# Altium schematic sheet Launchpad.SchDoc
size A4; Organization: Altium Limited; Address1: L3, 12a Rodborough Rd; Address2: Frenchs Forest; Address3: NSW; Address4: Australia 2086; SheetNumber: 2
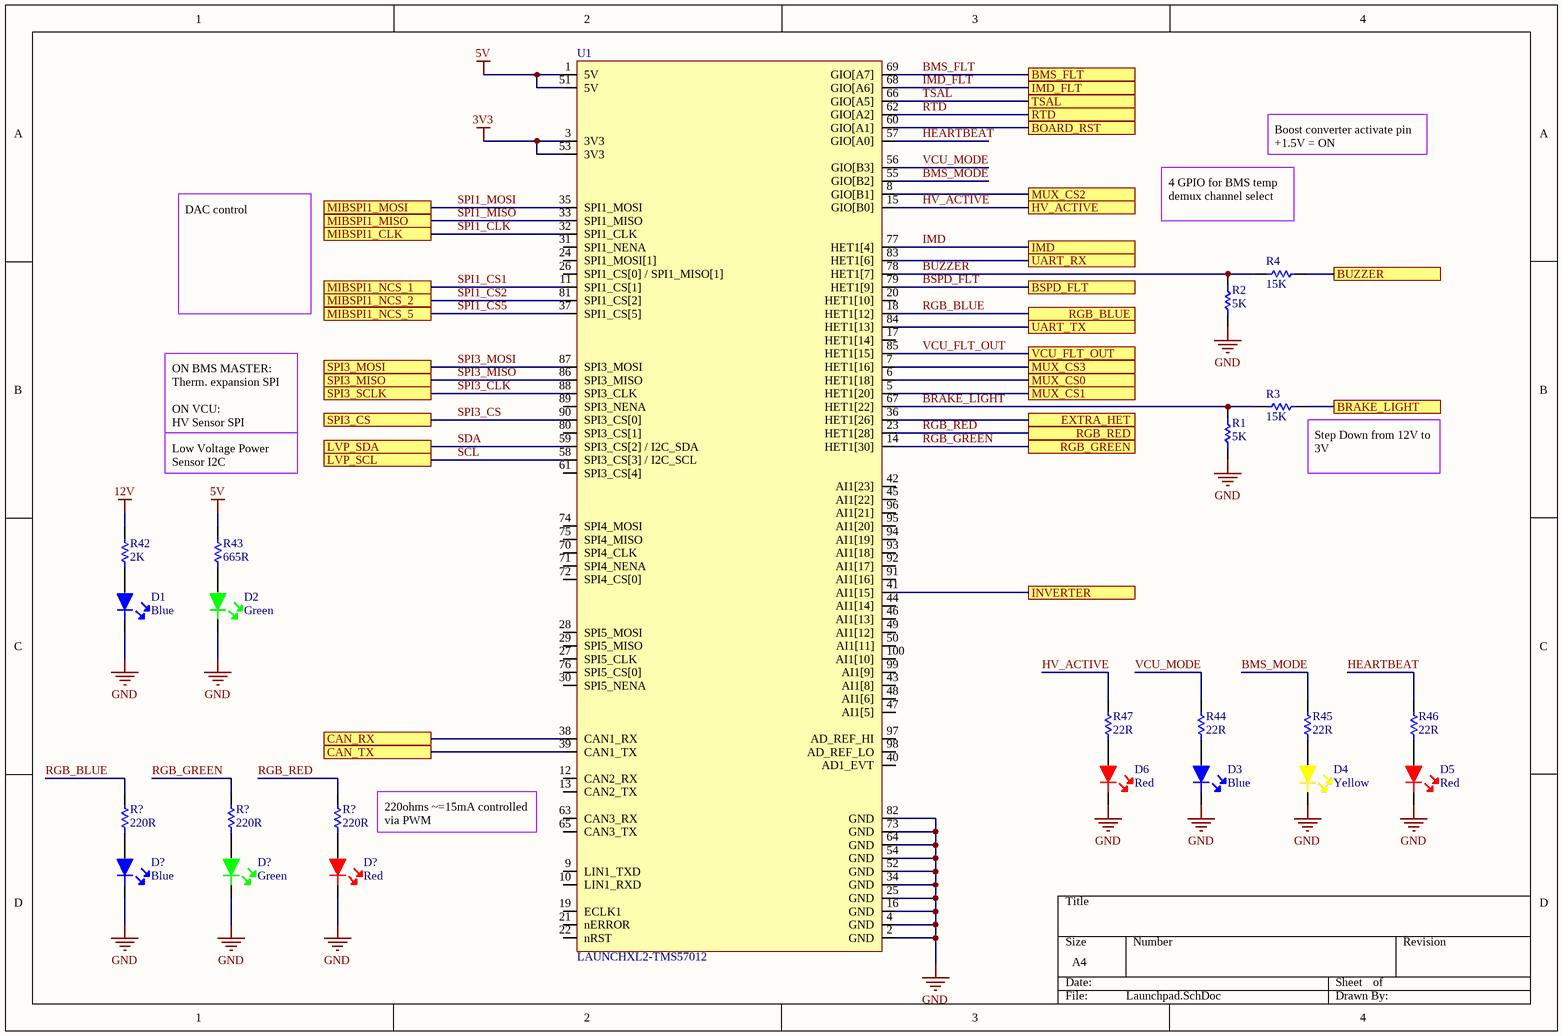
[diagram p0: Launchpad.SchDoc]

## Parts
(Parts that share a designator on the sheet are numbered #1, #2 ... from top to bottom, then left to right.)
D1  Blue  [LED-0603]
D2  Green  [LED-0603]
D3  Blue  [LED-0603]
D4  Yellow  [LED-0603]
D5  Red  [LED-0603]
D6  Red  [LED-0603]
D?#1  Blue  [LED-0603]
D?#2  Green  [LED-0603]
D?#3  Red  [LED-0603]
R1  5K  [RES-0603]
R2  5K  [RES-0603]
R3  15K  [RES-0603]
R4  15K  [RES-0603]
R42  2K  [RES-0603]
R43  665R  [RES-0603]
R44  22R  [RES-0603]
R45  22R  [RES-0603]
R46  22R  [RES-0603]
R47  22R  [RES-0603]
R?#1  220R  [RES-0603]
R?#2  220R  [RES-0603]
R?#3  220R  [RES-0603]
U1  LAUNCHXL2-TMS57012  [Hercules]

## Ports
BMS_FLT, BOARD_RST, BRAKE_LIGHT, BSPD_FLT, BUZZER, CAN_RX, CAN_TX, EXTRA_HET, HV_ACTIVE, IMD, IMD_FLT, INVERTER, LVP_SCL, LVP_SDA, MIBSPI1_CLK, MIBSPI1_MISO, MIBSPI1_MOSI, MIBSPI1_NCS_1, MIBSPI1_NCS_2, MIBSPI1_NCS_5, MUX_CS0, MUX_CS1, MUX_CS2, MUX_CS3, RGB_BLUE, RGB_GREEN, RGB_RED, RTD, SPI3_CS, SPI3_MISO, SPI3_MOSI, SPI3_SCLK, TSAL, UART_RX, UART_TX, VCU_FLT_OUT

## Nets
3V3: U1.3(3V3) U1.53(3V3)
5V: R43.2 U1.1(5V) U1.51(5V)
12V: R42.2
GND: D1.2 D2.2 D3.2 D4.2 D5.2 D6.2 D?#1.2 D?#2.2 D?#3.2 R1.1 R2.1 U1.2(GND) U1.4(GND) U1.16(GND) U1.25(GND) U1.34(GND) U1.52(GND) U1.54(GND) U1.64(GND) U1.73(GND) U1.82(GND)
BMS_FLT: U1.69(GIO[A7]) ; port BMS_FLT
BMS_MODE: R45.2 U1.55(GIO[B2])
BOARD_RST: U1.60(GIO[A1]) ; port BOARD_RST
BRAKE_LIGHT: R1.2 R3.1 U1.67(HET1[22])
BRAKE_LIGHT: R3.2 ; port BRAKE_LIGHT  [a separate net that carries the same name]
BSPD_FLT: U1.79(HET1[9]) ; port BSPD_FLT
BUZZER: R2.2 R4.1 U1.78(HET1[7])
BUZZER: R4.2 ; port BUZZER  [a separate net that carries the same name]
CAN_RX: U1.38(CAN1_RX) ; port CAN_RX
CAN_TX: U1.39(CAN1_TX) ; port CAN_TX
EXTRA_HET: U1.36(HET1[26]) ; port EXTRA_HET
HEARTBEAT: R46.2 U1.57(GIO[A0])
HV_ACTIVE: R47.2 U1.15(GIO[B0]) ; port HV_ACTIVE
IMD: U1.77(HET1[4]) ; port IMD
IMD_FLT: U1.68(GIO[A6]) ; port IMD_FLT
INVERTER: U1.41(AI1[15]) ; port INVERTER
MUX_CS0: U1.6(HET1[18]) ; port MUX_CS0
MUX_CS1: U1.5(HET1[20]) ; port MUX_CS1
MUX_CS2: U1.8(GIO[B1]) ; port MUX_CS2
MUX_CS3: U1.7(HET1[16]) ; port MUX_CS3
RGB_BLUE: R?#1.2 U1.18(HET1[12]) ; port RGB_BLUE
RGB_GREEN: R?#2.2 U1.14(HET1[30]) ; port RGB_GREEN
RGB_RED: R?#3.2 U1.23(HET1[28]) ; port RGB_RED
RTD: U1.62(GIO[A2]) ; port RTD
SCL: U1.58(SPI3_CS[3]_/_I2C_SCL) ; port LVP_SCL
SDA: U1.59(SPI3_CS[2]_/_I2C_SDA) ; port LVP_SDA
SPI1_CLK: U1.32(SPI1_CLK) ; port MIBSPI1_CLK
SPI1_CS1: U1.11(SPI1_CS[1]) ; port MIBSPI1_NCS_1
SPI1_CS2: U1.81(SPI1_CS[2]) ; port MIBSPI1_NCS_2
SPI1_CS5: U1.37(SPI1_CS[5]) ; port MIBSPI1_NCS_5
SPI1_MISO: U1.33(SPI1_MISO) ; port MIBSPI1_MISO
SPI1_MOSI: U1.35(SPI1_MOSI) ; port MIBSPI1_MOSI
SPI3_CLK: U1.88(SPI3_CLK) ; port SPI3_SCLK
SPI3_CS: U1.90(SPI3_CS[0]) ; port SPI3_CS
SPI3_MISO: U1.86(SPI3_MISO) ; port SPI3_MISO
SPI3_MOSI: U1.87(SPI3_MOSI) ; port SPI3_MOSI
TSAL: U1.66(GIO[A5]) ; port TSAL
UART_RX: U1.83(HET1[6]) ; port UART_RX
UART_TX: U1.84(HET1[13]) ; port UART_TX
VCU_FLT_OUT: U1.85(HET1[15]) ; port VCU_FLT_OUT
VCU_MODE: R44.2 U1.56(GIO[B3])
NetD1_1: D1.1 R42.1
NetD2_1: D2.1 R43.1
NetD3_1: D3.1 R44.1
NetD4_1: D4.1 R45.1
NetD5_1: D5.1 R46.1
NetD6_1: D6.1 R47.1
NetD?#1_1: D?#1.1 R?#1.1
NetD?#2_1: D?#2.1 R?#2.1
NetD?#3_1: D?#3.1 R?#3.1

Not connected (* = marked no-connect by the designer): U1 9(LIN1_TXD) 10(LIN1_RXD) 12(CAN2_RX) 13(CAN2_TX) 17(HET1[14]) 19(ECLK1) 20(HET1[10]) 21(nERROR) 22(nRST) 24(SPI1_MOSI[1]) 26(SPI1_CS[0]_/_SPI1_MISO[1]) 27(SPI5_CLK) 28(SPI5_MOSI) 29(SPI5_MISO) 30(SPI5_NENA) 31(SPI1_NENA) 40(AD1_EVT) 42(AI1[23]) 43(AI1[8]) 44(AI1[14]) 45(AI1[22]) 46(AI1[13]) 47(AI1[5]) 48(AI1[6]) 49(AI1[12]) 50(AI1[11]) 61(SPI3_CS[4]) 63(CAN3_RX) 65(CAN3_TX) 70(SPI4_CLK) 71(SPI4_NENA) 72(SPI4_CS[0]) 74(SPI4_MOSI) 75(SPI4_MISO) 76(SPI5_CS[0]) 80(SPI3_CS[1]) 89(SPI3_NENA) 91(AI1[16]) 92(AI1[17]) 93(AI1[18]) 94(AI1[19]) 95(AI1[20]) 96(AI1[21]) 97(AD_REF_HI) 98(AD_REF_LO) 99(AI1[9]) 100(AI1[10])

## Notes on the sheet
- Boost converter activate pin
  +1.5V = ON
- 4 GPIO for BMS temp demux channel select
- DAC control
- ON BMS MASTER:
  Therm. expansion SPI
  ON VCU:
  HV Sensor SPI
- Low Voltage Power Sensor I2C
- (near R3) Step Down from 12V to 3V
- 220ohms ~=15mA controlled via PWM
- Title
- Size:
- Date:
- B
- Number:
- Time:
- Revision:
- Sheet
- of
- File:

## Library data of the parts
D1 D3 D?#1 = LED-Blue: LED BLUE CLEAR 0603 SMD; Manufacturer: Wurth Electronics; Manufacturer Part Number: 150060BS75000; Luminous Intensity: 145mcd; Forward Current: 30mA; Forward Voltage: 3.2V; Wavelength: 470nm; Viewing Angle: 140°; Lens Style: Clear,Rectangular; Test Current: 20mA; Supplier 1: Digi-Key; Stock 1: 46078; Pricing 1: 1=0.16, 50=0.145, 100=0.125, 500=0.108 (USD); Mount: Surface Mount; Case/Package: 0603; Color: Blue; Case Code (Metric): 1608; Case Code (Imperial): 0603; Min Operating Temperature: -40°C; Max Operating Temperature: 85°C; Package Quantity: 4000; Packaging: Cut Tape; Dominant Wavelength: 470nm; Length: 1.6mm; Height: 0.7mm; Width: 0.8mm; REACH SVHC: Unknown; ComponentLink1URL: https://www.distrelec.biz/Web/Downloads/_t/ds/150060BS75000_eng_tds.pdf?mime=application%2Fpdf&src-supplier=Distrelec; ComponentLink1Description: https://www.distrelec.biz/Web/Downloads/_t/ds/150060BS75000_eng_tds.pdf?mime=application%2Fpdf&src-supplier=Distrelec; ComponentLink2URL: https://katalog.we-online.de/led/datasheet/150060BS75000.pdf?src-supplier=Digi-Key; ComponentLink2Description: https://katalog.we-online.de/led/datasheet/150060BS75000.pdf?src-supplier=Digi-Key; ComponentLink3URL: http://www.farnell.com/datasheets/1911343.pdf?src-supplier=Element14; ComponentLink3Description: http://www.farnell.com/datasheets/1911343.pdf?src-supplier=Element14; ComponentLink4URL: http://www.produktinfo.conrad.com/datenblaetter/750000-774999/759426-da-01-en-CHIPLED_0603_W_KL_BLAU_150060BS75000.pdf?src-supplier=Conrad; ComponentLink4Description: http://www.produktinfo.conrad.com/datenblaetter/750000-774999/759426-da-01-en-CHIPLED_0603_W_KL_BLAU_150060BS75000.pdf?src-supplier=Conrad; Supplier Part Number 1: 732-4966-6-ND
D2 D?#2 = LED-Green: LED GREEN CLEAR 0603 SMD; Manufacturer: Wurth Electronics; Manufacturer Part Number: 150060VS75000; Luminous Intensity: 40mcd; Viewing Angle: 140°; Forward Voltage: 2V; Wavelength: 570nm; Lens Style: Clear,Rectangular; Forward Current: 30mA; Test Current: 20mA; Supplier 1: Digi-Key; Stock 1: 118118; Pricing 1: 1=0.14, 50=0.133, 100=0.114, 500=0.099 (USD); Mount: Surface Mount; Case/Package: 0603; Number of Pins: 2; Color: Green; Case Code (Metric): 1608; Case Code (Imperial): 0603; Min Operating Temperature: -40°C; Max Operating Temperature: 85°C; Package Quantity: 1; Packaging: Tape and Reel; Dominant Wavelength: 570nm; Length: 1.6mm; Height: 0.7mm; Width: 0.8mm; REACH SVHC: Unknown; ComponentLink1URL: https://katalog.we-online.de/led/datasheet/150060VS75000.pdf?src-supplier=Digi-Key; ComponentLink1Description: https://katalog.we-online.de/led/datasheet/150060VS75000.pdf?src-supplier=Digi-Key; Supplier Part Number 1: 732-4980-1-ND
D4 = LED-Yellow: LED YELLOW CLEAR 0603 SMD; Manufacturer: Wurth Electronics; Manufacturer Part Number: 150060YS75000; Viewing Angle: 140°; Lens Style: Clear,Rectangular; Wavelength: 590nm; Luminous Intensity: 120mcd; Forward Voltage: 2V; Forward Current: 30mA; Test Current: 20mA; Supplier 1: Digi-Key; Stock 1: 78; Pricing 1: 1=0.14, 50=0.133, 100=0.114, 500=0.099 (USD); Mount: Surface Mount; Case/Package: 0603; Case Code (Metric): 1608; Case Code (Imperial): 0603; Color: Yellow; Min Operating Temperature: -40°C; Max Operating Temperature: 85°C; Package Quantity: 4000; Packaging: Tape and Reel; Dominant Wavelength: 590nm; Length: 1.6mm; Height: 0.7mm; Width: 0.8mm; REACH SVHC: Unknown; ComponentLink1URL: http://katalog.we-online.de/led/datasheet/150060YS75000.pdf?src-supplier=Newark; ComponentLink1Description: http://katalog.we-online.de/led/datasheet/150060YS75000.pdf?src-supplier=Newark; ComponentLink2URL: https://katalog.we-online.de/led/datasheet/150060YS75000.pdf?src-supplier=Digi-Key; ComponentLink2Description: https://katalog.we-online.de/led/datasheet/150060YS75000.pdf?src-supplier=Digi-Key; ComponentLink3URL: http://www.farnell.com/datasheets/1911348.pdf?src-supplier=Element14; ComponentLink3Description: http://www.farnell.com/datasheets/1911348.pdf?src-supplier=Element14; ComponentLink4URL: https://www.distrelec.biz/Web/Downloads/_t/ds/150060YS75000_eng_tds.pdf?mime=application%2Fpdf&src-supplier=Distrelec; ComponentLink4Description: https://www.distrelec.biz/Web/Downloads/_t/ds/150060YS75000_eng_tds.pdf?mime=application%2Fpdf&src-supplier=Distrelec; ComponentLink5URL: http://www.produktinfo.conrad.com/datenblaetter/750000-774999/759432-da-01-en-CHIPLED_0603_W_KL_GELB_150060YS75000.pdf?src-supplier=Conrad; ComponentLink5Description: http://www.produktinfo.conrad.com/datenblaetter/750000-774999/759432-da-01-en-CHIPLED_0603_W_KL_GELB_150060YS75000.pdf?src-supplier=Conrad; Supplier Part Number 1: 732-4981-6-ND
D5 D6 D?#3 = LED-Red: LED RED CLEAR 0603 SMD; Manufacturer: Wurth Electronics; Manufacturer Part Number: 150060RS75000; Viewing Angle: 140°; Lens Style: Clear,Rectangular; Luminous Intensity: 250mcd; Forward Current: 30mA; Forward Voltage: 2V; Wavelength: 625nm; Test Current: 20mA; Supplier 1: Digi-Key; Stock 1: 18518; Pricing 1: 1=0.14, 50=0.133, 100=0.114, 500=0.099 (USD); Mount: Surface Mount; Case/Package: 0603; Color: Red; Case Code (Metric): 1608; Case Code (Imperial): 0603; Min Operating Temperature: -40°C; Max Operating Temperature: 85°C; Package Quantity: 1; Packaging: Cut Tape; Dominant Wavelength: 625nm; Length: 1.6mm; Height: 0.7mm; Width: 0.8mm; REACH SVHC: Unknown; ComponentLink1URL: https://katalog.we-online.de/led/datasheet/150060RS75000.pdf?src-supplier=Digi-Key; ComponentLink1Description: https://katalog.we-online.de/led/datasheet/150060RS75000.pdf?src-supplier=Digi-Key; ComponentLink2URL: http://www.produktinfo.conrad.com/datenblaetter/750000-774999/759428-da-01-en-CHIPLED_0603_W_KL_ROT_150060RS75000.pdf?src-supplier=Conrad; ComponentLink2Description: http://www.produktinfo.conrad.com/datenblaetter/750000-774999/759428-da-01-en-CHIPLED_0603_W_KL_ROT_150060RS75000.pdf?src-supplier=Conrad; Supplier Part Number 1: 732-4978-6-ND
R1 R2 = 0603-5KR: RES SMD 4.99K OHM 1% 1/10W 0603; Manufacturer: Bourns; Manufacturer Part Number: CR0603-FX-4991ELF; Resistance: 4.99kR; Power Rating: 100mW; Voltage Rating: 50V; Temperature Coefficient: 100ppm/°C; Supplier 1: Digi-Key; Stock 1: 70557; Pricing 1: 1=0.1, 10=0.02, 25=0.0144, 50=0.011, 100=0.0082, 250=0.00624, 500=0.00498, 1000=0.00367 (USD); Mount: Surface Mount; Case/Package: 0603; Case Code (Imperial): 0603; Case Code (Metric): 1608; Contact Plating: Tin; Min Operating Temperature: -55°C; Max Operating Temperature: 155°C; Tolerance: 1%; Packaging: Tape and Reel; Package Quantity: 1; Composition: Thick Film; Termination: SMD/SMT; Number of Terminations: 2; Max Power Dissipation: 100mW; Features: Moisture Resistant; Length: 0.063inch; Height: 0.022inch; Width: 0.8mm; Thickness: 457um; Radiation Hardening: No; ComponentLink1URL: https://www.bourns.com/docs/Product-Datasheets/CHPREZTR.pdf?src-supplier=Digi-Key; ComponentLink1Description: https://www.bourns.com/docs/Product-Datasheets/CHPREZTR.pdf?src-supplier=Digi-Key; ComponentLink2URL: http://www.bourns.com/pdfs/chpreztr.pdf?src-supplier=Avnet; ComponentLink2Description: http://www.bourns.com/pdfs/chpreztr.pdf?src-supplier=Avnet; Supplier Part Number 1: CR0603-FX-4991ELFDKR-ND
R3 R4 = 0603-15KR: RES SMD 15K OHM 1% 1/10W 0603; Manufacturer: Yageo; Manufacturer Part Number: RC0603FR-0715KL; Resistance: 15kR; Temperature Coefficient: 100ppm/°C; Voltage Rating (DC): 50V; Power Rating: 100mW; Supplier 1: Digi-Key; Stock 1: 4670222; Pricing 1: 1=0.1, 10=0.023, 100=0.0094, 1000=0.00421, 2500=0.00366 (USD); Case/Package: 0603; Number of Pins: 2; Case Code (Metric): 1608; Case Code (Imperial): 0603; Min Operating Temperature: -55°C; Max Operating Temperature: 155°C; Tolerance: 1%; Packaging: Tape and Reel; Composition: Thick Film; Package Quantity: 1; Voltage Rating: 50V; Number of Terminations: 2; Termination: SMD/SMT; Military Standard: Not; Max Power Dissipation: 100mW; Features: Moisture Resistant; Length: 1.6mm; Height: 0.022inch; Width: 0.031inch; Depth: 0.8mm; REACH SVHC: Unknown; Lead Free: Lead Free; ComponentLink1URL: http://www.yageo.com/documents/recent/PYu-RC_Group_51_RoHS_L_10.pdf?src-supplier=Digi-Key; ComponentLink1Description: http://www.yageo.com/documents/recent/PYu-RC_Group_51_RoHS_L_10.pdf?src-supplier=Digi-Key; ComponentLink2URL: http://www.yageo.com/documents/recent/PYu-RC_Group_51_RoHS_L_9.pdf?src-supplier=Digi-Key; ComponentLink2Description: http://www.yageo.com/documents/recent/PYu-RC_Group_51_RoHS_L_9.pdf?src-supplier=Digi-Key; ComponentLink3URL: https://www.verical.com/server-webapp/html/getDatasheet?partID=327895&src-supplier=Verical; ComponentLink3Description: https://www.verical.com/server-webapp/html/getDatasheet?partID=327895&src-supplier=Verical; Supplier Part Number 1: 311-15.0KHRDKR-ND
R42 R?#1 = 0603-2KR: RES SMD 2K OHM 1% 1/4W 0603; Manufacturer: Vishay Dale; Manufacturer Part Number: CRCW06032K00FKEAHP; Resistance: 2kR; Power Rating: 250mW; Voltage Rating: 75V; Temperature Coefficient: 100ppm/°C; Supplier 1: Digi-Key; Stock 1: 23723; Pricing 1: 1=0.17, 10=0.142, 100=0.0553, 1000=0.02317, 2500=0.02124 (USD); Mount: Surface Mount; Case/Package: 0603; Weight: 7.1E-05oz; Case Code (Metric): 1608; Case Code (Imperial): 0603; Contact Plating: Tin; Min Operating Temperature: -55°C; Max Operating Temperature: 155°C; Package Quantity: 10; Tolerance: 1%; Packaging: Tape and Reel; Composition: Thick Film; Number of Terminations: 2; Termination: Solder; Max Power Dissipation: 250mW; Features: Automotive AEC-Q200; Military Standard: Not; Length: 1.6mm; Height: 0.45mm; Width: 0.033inch; Depth: 0.85mm; Radiation Hardening: No; Lead Free: Lead Free; ComponentLink1URL: http://www.vishay.com/docs/20043/crcwhpe3.pdf?src-supplier=Digi-Key; ComponentLink1Description: http://www.vishay.com/docs/20043/crcwhpe3.pdf?src-supplier=Digi-Key; Supplier Part Number 1: 541-2.00KSDKR-ND
R43 = 0603-665R: RES SMD 665 OHM 1% 1/10W 0603; Manufacturer: Yageo; Manufacturer Part Number: RC0603FR-07665RL; Power Rating: 100mW; Voltage Rating: 75V; Temperature Coefficient: 100ppm/°C; Voltage Rating (DC): 50V; Supplier 1: Digi-Key; Stock 1: 143871; Pricing 1: 1=0.1, 10=0.023, 100=0.0094, 1000=0.00421, 2500=0.00366 (USD); Case/Package: 0603; Weight: 7.1E-05oz; Case Code (Imperial): 0603; Case Code (Metric): 1608; Contact Plating: Tin,Matte; Min Operating Temperature: -55°C; Max Operating Temperature: 155°C; Resistance: 665R; Tolerance: 1%; Packaging: Tape and Reel; Termination: SMD/SMT; Composition: Thick Film; Military Standard: Not; Package Quantity: 1; Number of Terminations: 2; Max Power Dissipation: 100mW; Features: Moisture Resistant; Length: 1.6mm; Height: 0.022inch; Width: 0.8mm; Depth: 0.8mm; Lead Free: Lead Free; ComponentLink1URL: http://www.yageo.com/documents/recent/PYu-RC_Group_51_RoHS_L_9.pdf?src-supplier=Digi-Key; ComponentLink1Description: http://www.yageo.com/documents/recent/PYu-RC_Group_51_RoHS_L_9.pdf?src-supplier=Digi-Key; ComponentLink2URL: http://www.yageo.com/documents/recent/PYu-RC0603_51_RoHS_L_4.pdf?src-supplier=Avnet; ComponentLink2Description: http://www.yageo.com/documents/recent/PYu-RC0603_51_RoHS_L_4.pdf?src-supplier=Avnet; ComponentLink3URL: http://www.yageo.com/documents/recent/PYu-RC_Group_51_RoHS_L_10.pdf?src-supplier=Digi-Key; ComponentLink3Description: http://www.yageo.com/documents/recent/PYu-RC_Group_51_RoHS_L_10.pdf?src-supplier=Digi-Key; ComponentLink4URL: http://www.yageo.com/documents/recent/PYu-RC0603_51_RoHS_L_4.pdf?src-supplier=Avnet+Europe; ComponentLink4Description: http://www.yageo.com/documents/recent/PYu-RC0603_51_RoHS_L_4.pdf?src-supplier=Avnet+Europe; Supplier Part Number 1: 311-665HRDKR-ND
R44-R47 = 0603-22R: RES SMD 22 OHM 1% 1/10W; Manufacturer: Yageo; Manufacturer Part Number: RC0603FR-0722RL; Voltage Rating (DC): 50V; Temperature Coefficient: 100ppm/°C; Power Rating: 100mW; Supplier 1: Digi-Key; Stock 1: 2467850; Pricing 1: 1=0.1, 10=0.023, 100=0.0094, 1000=0.00421, 2500=0.00366 (USD); Case/Package: 0603; Number of Pins: 2; Case Code (Metric): 1608; Case Code (Imperial): 0603; Min Operating Temperature: -55°C; Max Operating Temperature: 155°C; Tolerance: 1%; Resistance: 22R; Packaging: Tape and Reel; Composition: Thick Film; Voltage Rating: 50V; Package Quantity: 1; Number of Terminations: 2; Termination: SMD/SMT; Military Standard: Not; Max Power Dissipation: 100mW; Features: Moisture Resistant; Length: 1.6mm; Height: 0.022inch; Width: 0.031inch; Depth: 0.8mm; REACH SVHC: No SVHC; Lead Free: Lead Free; ComponentLink1URL: http://www.yageo.com/documents/recent/PYu-RC_Group_51_RoHS_L_10.pdf?src-supplier=Digi-Key; ComponentLink1Description: http://www.yageo.com/documents/recent/PYu-RC_Group_51_RoHS_L_10.pdf?src-supplier=Digi-Key; ComponentLink2URL: http://documents.rs-components.com/techlib://itc_doclist_GB.htm?stockno=5050369&src-supplier=RSComponents; ComponentLink2Description: http://documents.rs-components.com/techlib://itc_doclist_GB.htm?stockno=5050369&src-supplier=RSComponents; ComponentLink3URL: http://www.farnell.com/datasheets/2167052.pdf?src-supplier=Element14; ComponentLink3Description: http://www.farnell.com/datasheets/2167052.pdf?src-supplier=Element14; ComponentLink4URL: http://www.farnell.com/datasheets/443971.pdf?src-supplier=Element14; ComponentLink4Description: http://www.farnell.com/datasheets/443971.pdf?src-supplier=Element14; Supplier Part Number 1: 311-22.0HRDKR-ND
R?#2 = 0603-665R: RES SMD 665 OHM 1% 1/10W 0603; Manufacturer: Yageo; Manufacturer Part Number: RC0603FR-07665RL; Resistance: 665R; Power Rating: 100mW; Voltage Rating: 75V; Temperature Coefficient: 100ppm/°C; Voltage Rating (DC): 50V; Supplier 1: Digi-Key; Stock 1: 143871; Pricing 1: 1=0.1, 10=0.023, 100=0.0094, 1000=0.00421, 2500=0.00366 (USD); Case/Package: 0603; Weight: 7.1E-05oz; Case Code (Imperial): 0603; Case Code (Metric): 1608; Contact Plating: Tin,Matte; Min Operating Temperature: -55°C; Max Operating Temperature: 155°C; Tolerance: 1%; Packaging: Tape and Reel; Termination: SMD/SMT; Composition: Thick Film; Military Standard: Not; Package Quantity: 1; Number of Terminations: 2; Max Power Dissipation: 100mW; Features: Moisture Resistant; Length: 1.6mm; Height: 0.022inch; Width: 0.8mm; Depth: 0.8mm; Lead Free: Lead Free; ComponentLink1URL: http://www.yageo.com/documents/recent/PYu-RC_Group_51_RoHS_L_9.pdf?src-supplier=Digi-Key; ComponentLink1Description: http://www.yageo.com/documents/recent/PYu-RC_Group_51_RoHS_L_9.pdf?src-supplier=Digi-Key; ComponentLink2URL: http://www.yageo.com/documents/recent/PYu-RC0603_51_RoHS_L_4.pdf?src-supplier=Avnet; ComponentLink2Description: http://www.yageo.com/documents/recent/PYu-RC0603_51_RoHS_L_4.pdf?src-supplier=Avnet; ComponentLink3URL: http://www.yageo.com/documents/recent/PYu-RC_Group_51_RoHS_L_10.pdf?src-supplier=Digi-Key; ComponentLink3Description: http://www.yageo.com/documents/recent/PYu-RC_Group_51_RoHS_L_10.pdf?src-supplier=Digi-Key; ComponentLink4URL: http://www.yageo.com/documents/recent/PYu-RC0603_51_RoHS_L_4.pdf?src-supplier=Avnet+Europe; ComponentLink4Description: http://www.yageo.com/documents/recent/PYu-RC0603_51_RoHS_L_4.pdf?src-supplier=Avnet+Europe; Supplier Part Number 1: 311-665HRDKR-ND
R?#3 = 0603-22R: RES SMD 22 OHM 1% 1/10W; Manufacturer: Yageo; Manufacturer Part Number: RC0603FR-0722RL; Voltage Rating (DC): 50V; Resistance: 22R; Temperature Coefficient: 100ppm/°C; Power Rating: 100mW; Supplier 1: Digi-Key; Stock 1: 2467850; Pricing 1: 1=0.1, 10=0.023, 100=0.0094, 1000=0.00421, 2500=0.00366 (USD); Case/Package: 0603; Number of Pins: 2; Case Code (Metric): 1608; Case Code (Imperial): 0603; Min Operating Temperature: -55°C; Max Operating Temperature: 155°C; Tolerance: 1%; Packaging: Tape and Reel; Composition: Thick Film; Voltage Rating: 50V; Package Quantity: 1; Number of Terminations: 2; Termination: SMD/SMT; Military Standard: Not; Max Power Dissipation: 100mW; Features: Moisture Resistant; Length: 1.6mm; Height: 0.022inch; Width: 0.031inch; Depth: 0.8mm; REACH SVHC: No SVHC; Lead Free: Lead Free; ComponentLink1URL: http://www.yageo.com/documents/recent/PYu-RC_Group_51_RoHS_L_10.pdf?src-supplier=Digi-Key; ComponentLink1Description: http://www.yageo.com/documents/recent/PYu-RC_Group_51_RoHS_L_10.pdf?src-supplier=Digi-Key; ComponentLink2URL: http://documents.rs-components.com/techlib://itc_doclist_GB.htm?stockno=5050369&src-supplier=RSComponents; ComponentLink2Description: http://documents.rs-components.com/techlib://itc_doclist_GB.htm?stockno=5050369&src-supplier=RSComponents; ComponentLink3URL: http://www.farnell.com/datasheets/2167052.pdf?src-supplier=Element14; ComponentLink3Description: http://www.farnell.com/datasheets/2167052.pdf?src-supplier=Element14; ComponentLink4URL: http://www.farnell.com/datasheets/443971.pdf?src-supplier=Element14; ComponentLink4Description: http://www.farnell.com/datasheets/443971.pdf?src-supplier=Element14; Supplier Part Number 1: 311-22.0HRDKR-ND
U1 = Hercules Launchpad: LAUNCHPAD TMS570LS12X EVAL BRD; Manufacturer: Texas Instruments; Evaluation Kit: Yes; Number of Bits: 32; Core Architecture: ARM; Supplier 1: Digi-Key; Manufacturer Part Number: LAUNCHXL2-TMS57012; Stock 1: 26; Pricing 1: 1=59.99 (USD); Packaging: Bulk; Package Quantity: 1; REACH SVHC: No SVHC; ComponentLink1URL: http://www.ti.com/tool/LAUNCHXL2-TMS57012?keyMatch=LAUNCHXL2-TMS57012&tisearch=Search-EN&src-supplier=Avnet+Asia; ComponentLink1Description: http://www.ti.com/tool/LAUNCHXL2-TMS57012?keyMatch=LAUNCHXL2-TMS57012&tisearch=Search-EN&src-supplier=Avnet+Asia; ComponentLink2URL: http://www.ti.com/lit/pdf/spnu611?src-supplier=Digi-Key; ComponentLink2Description: http://www.ti.com/lit/pdf/spnu611?src-supplier=Digi-Key; ComponentLink3URL: http://www.ti.com/lit/pdf/spnu611?src-supplier=Mouser; ComponentLink3Description: http://www.ti.com/lit/pdf/spnu611?src-supplier=Mouser; ComponentLink4URL: http://www.ti.com/tool/LAUNCHXL2-TMS57012?keyMatch=LAUNCHXL2-TMS57012&tisearch=Search-EN&src-supplier=Avnet; ComponentLink4Description: http://www.ti.com/tool/LAUNCHXL2-TMS57012?keyMatch=LAUNCHXL2-TMS57012&tisearch=Search-EN&src-supplier=Avnet; Supplier Part Number 1: 296-41109-ND